# Altium schematic sheet Public_CPU_DDR4.SchDoc
size D
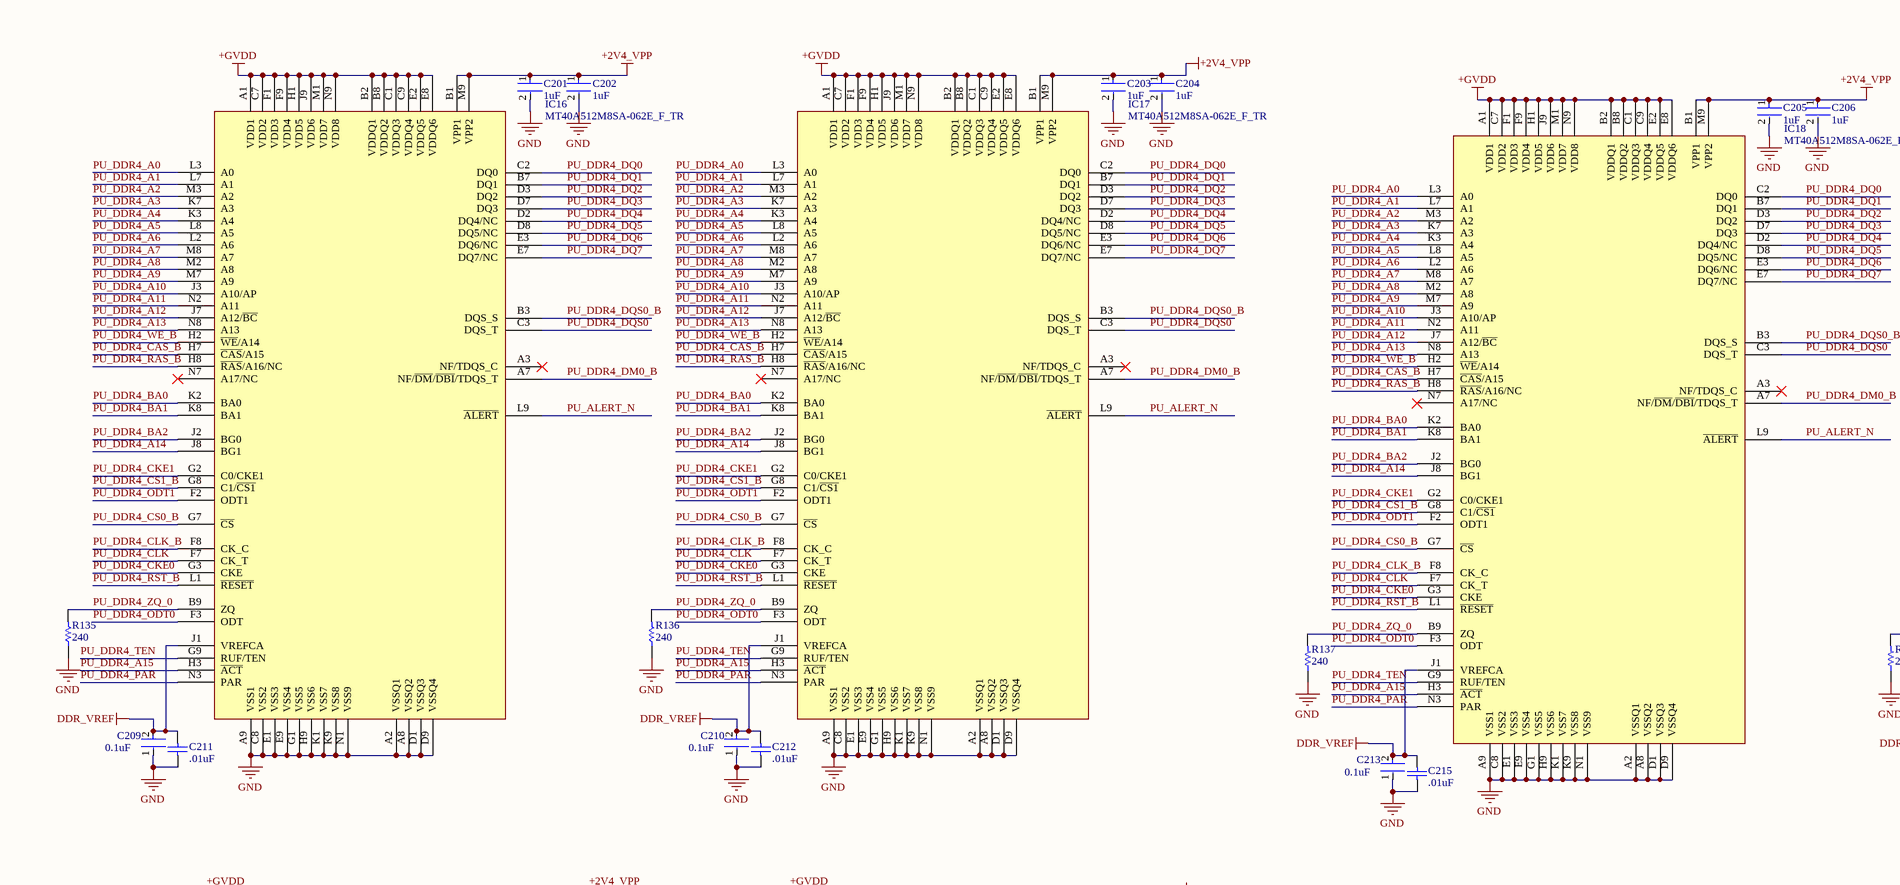
[diagram p0: Public_CPU_DDR4.SchDoc, top left]
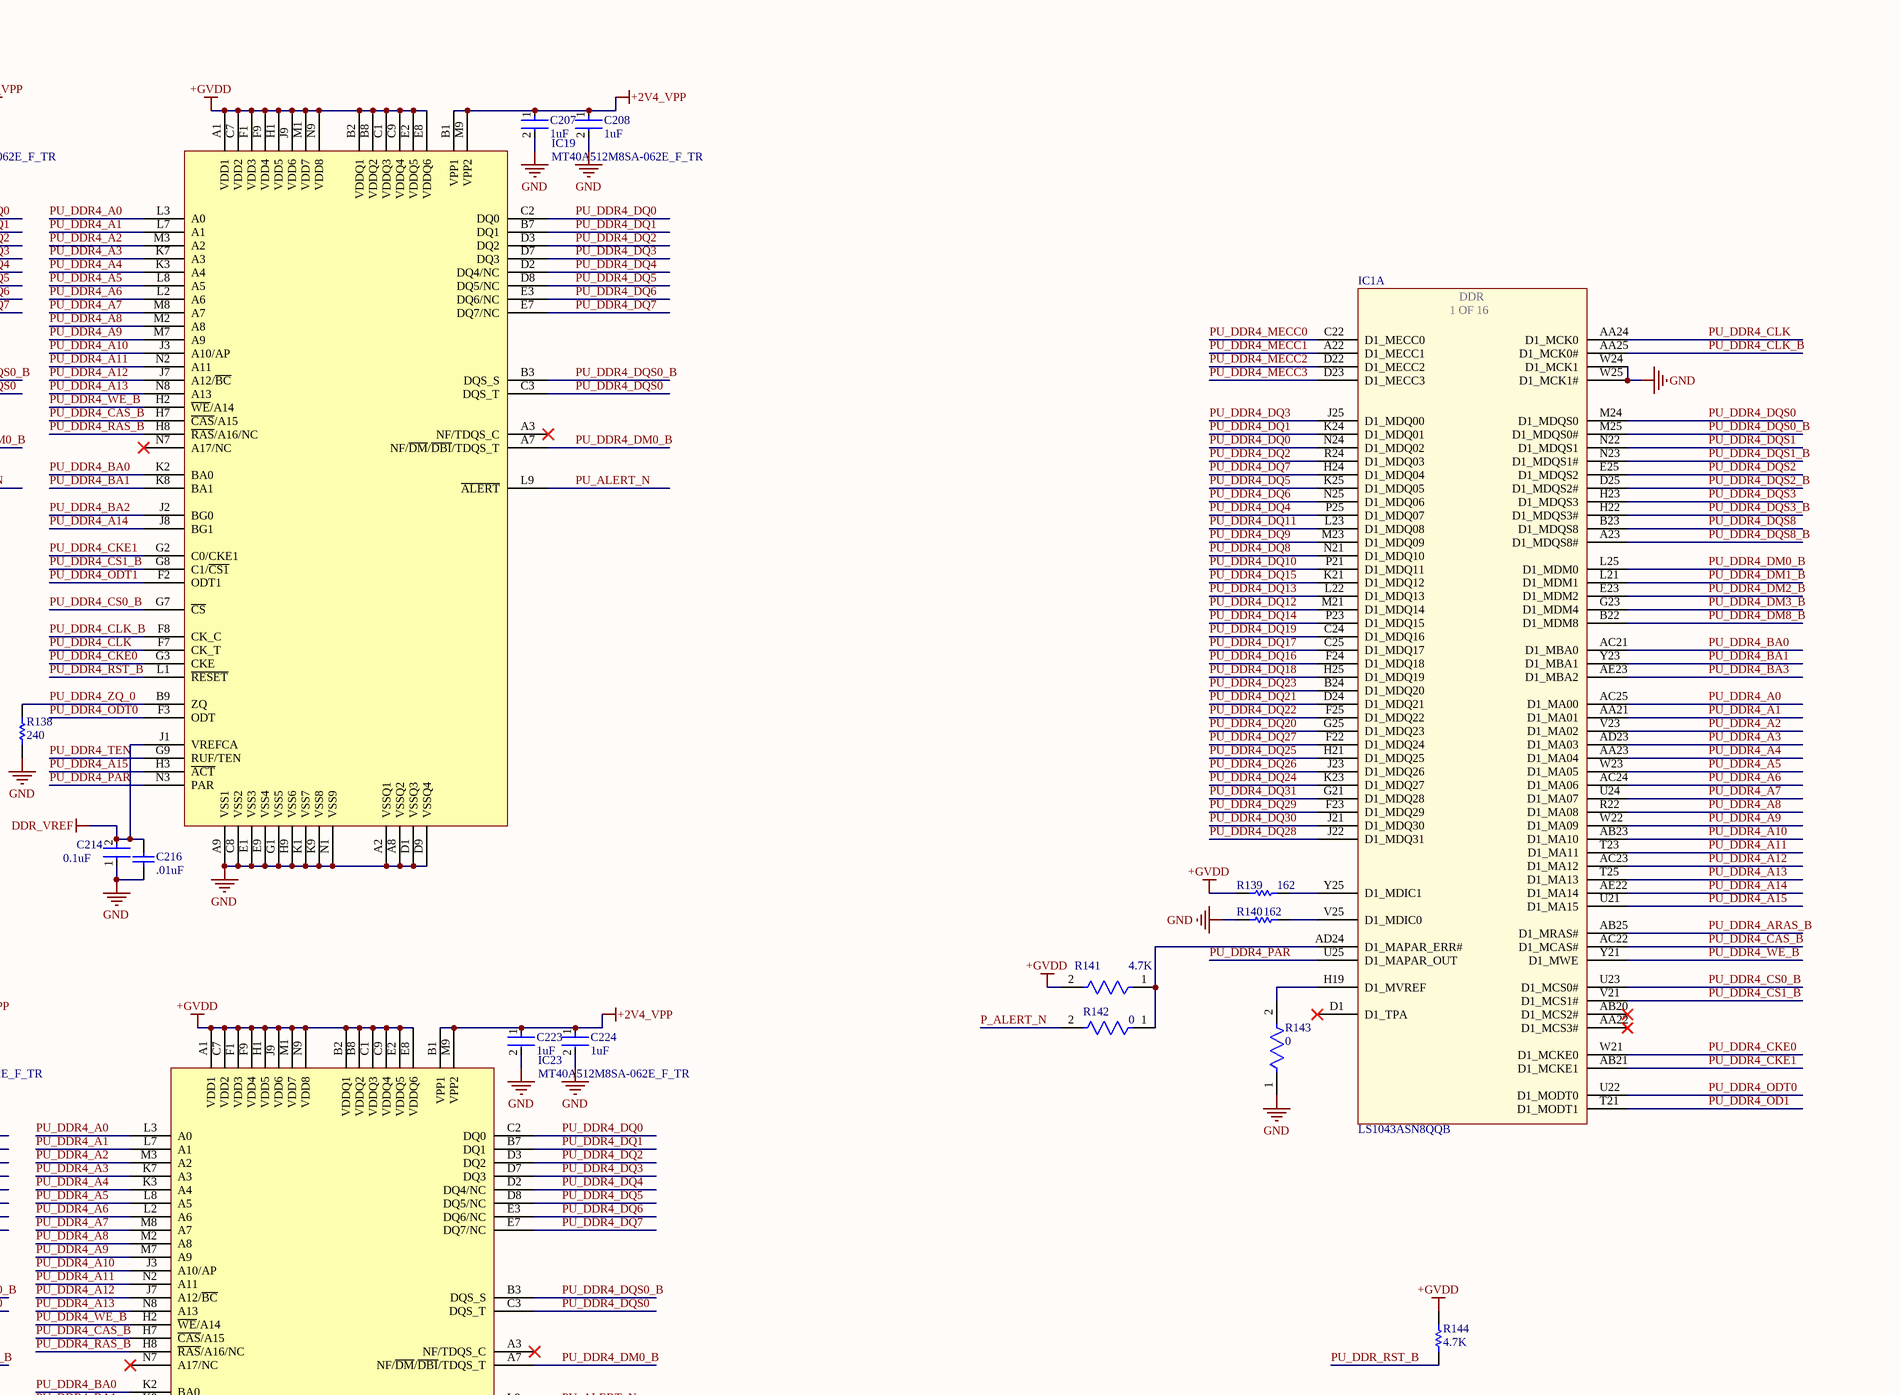
[diagram p1: Public_CPU_DDR4.SchDoc, top right]
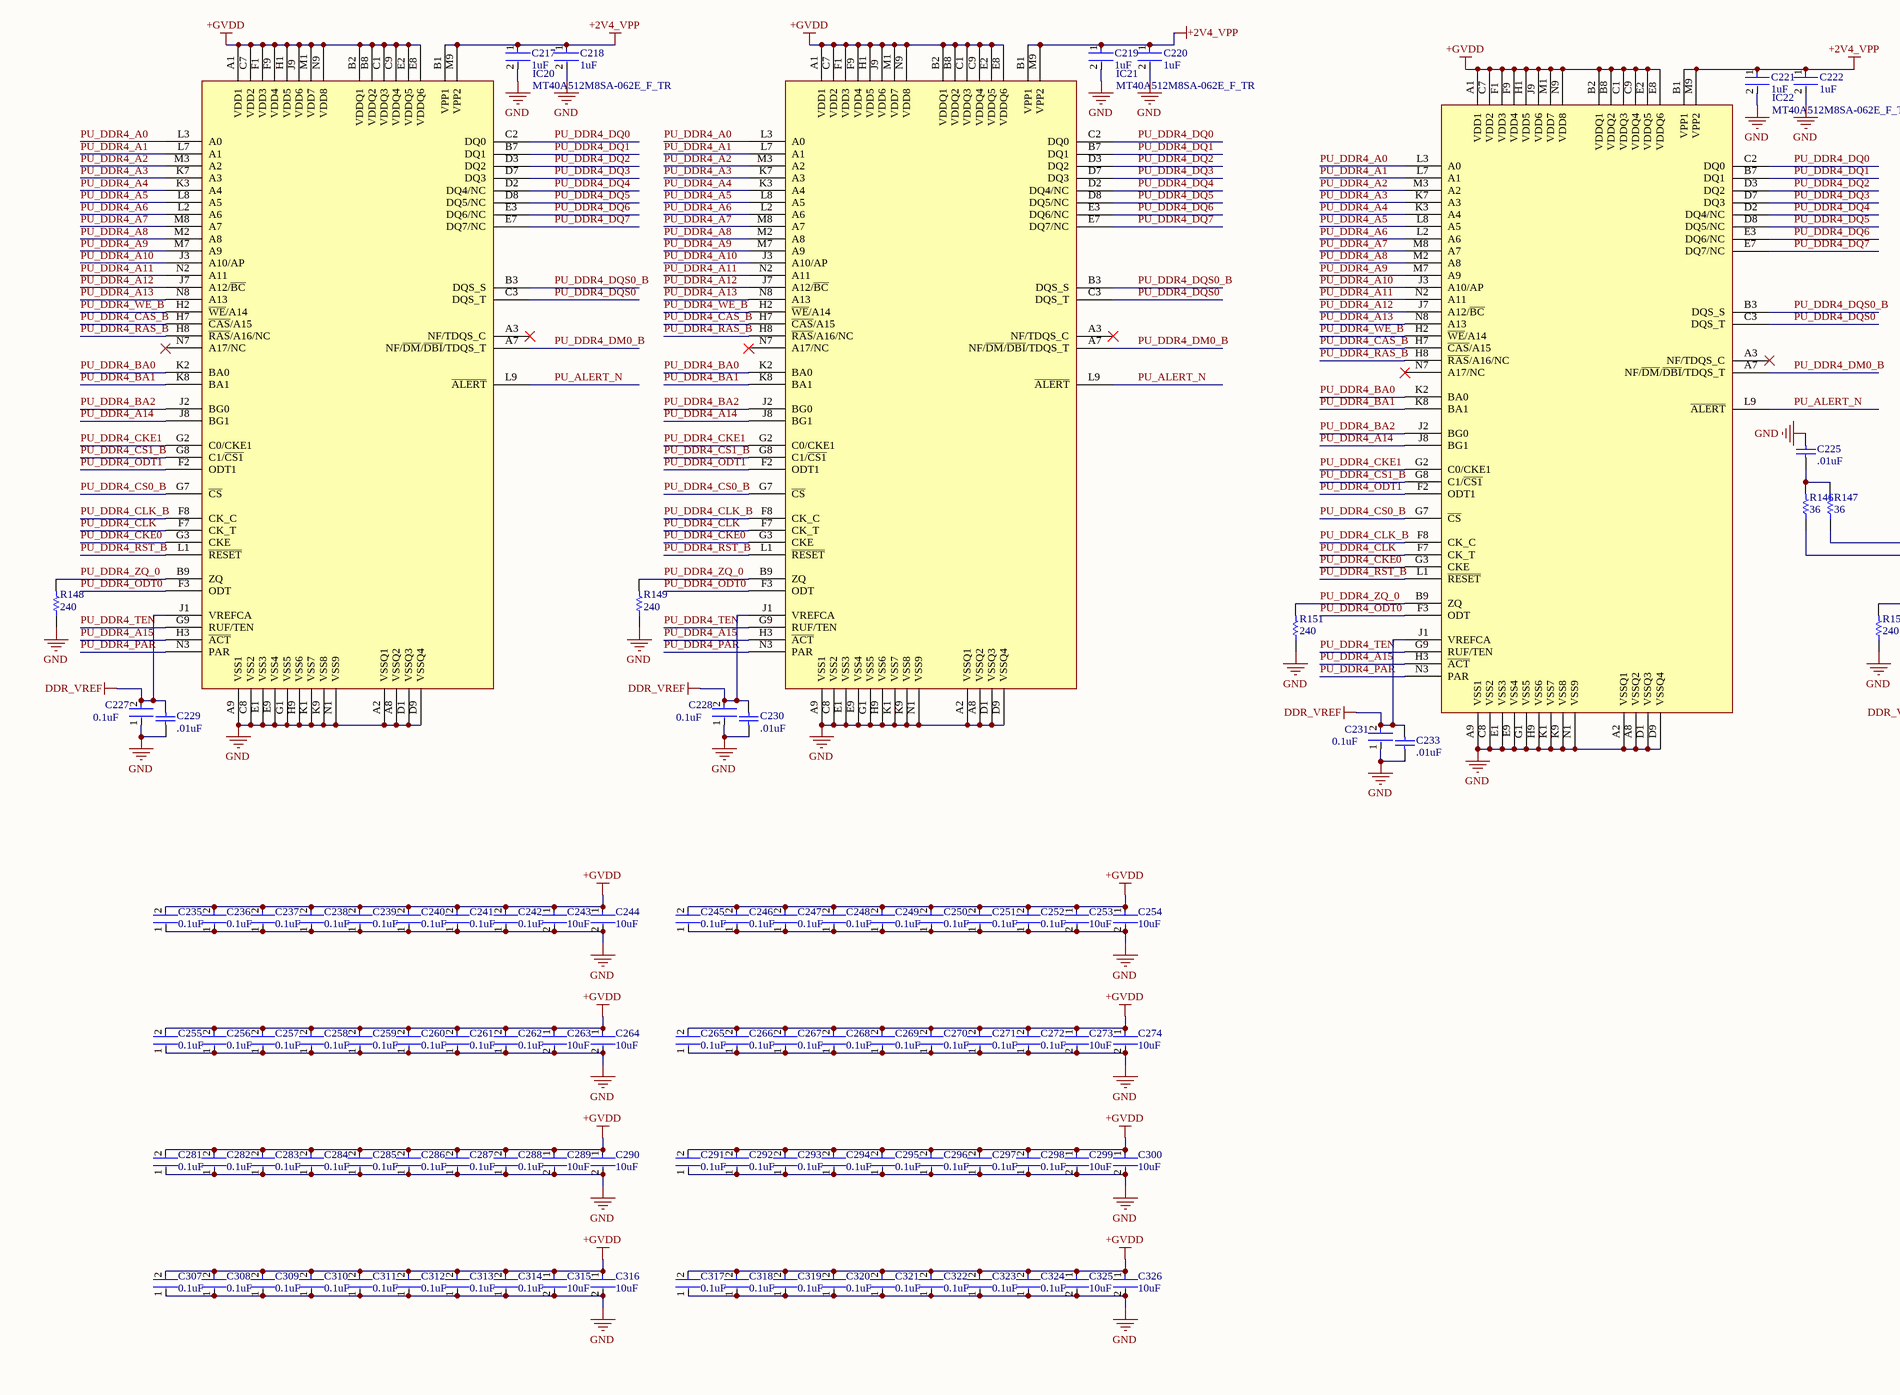
[diagram p2: Public_CPU_DDR4.SchDoc, bottom left]
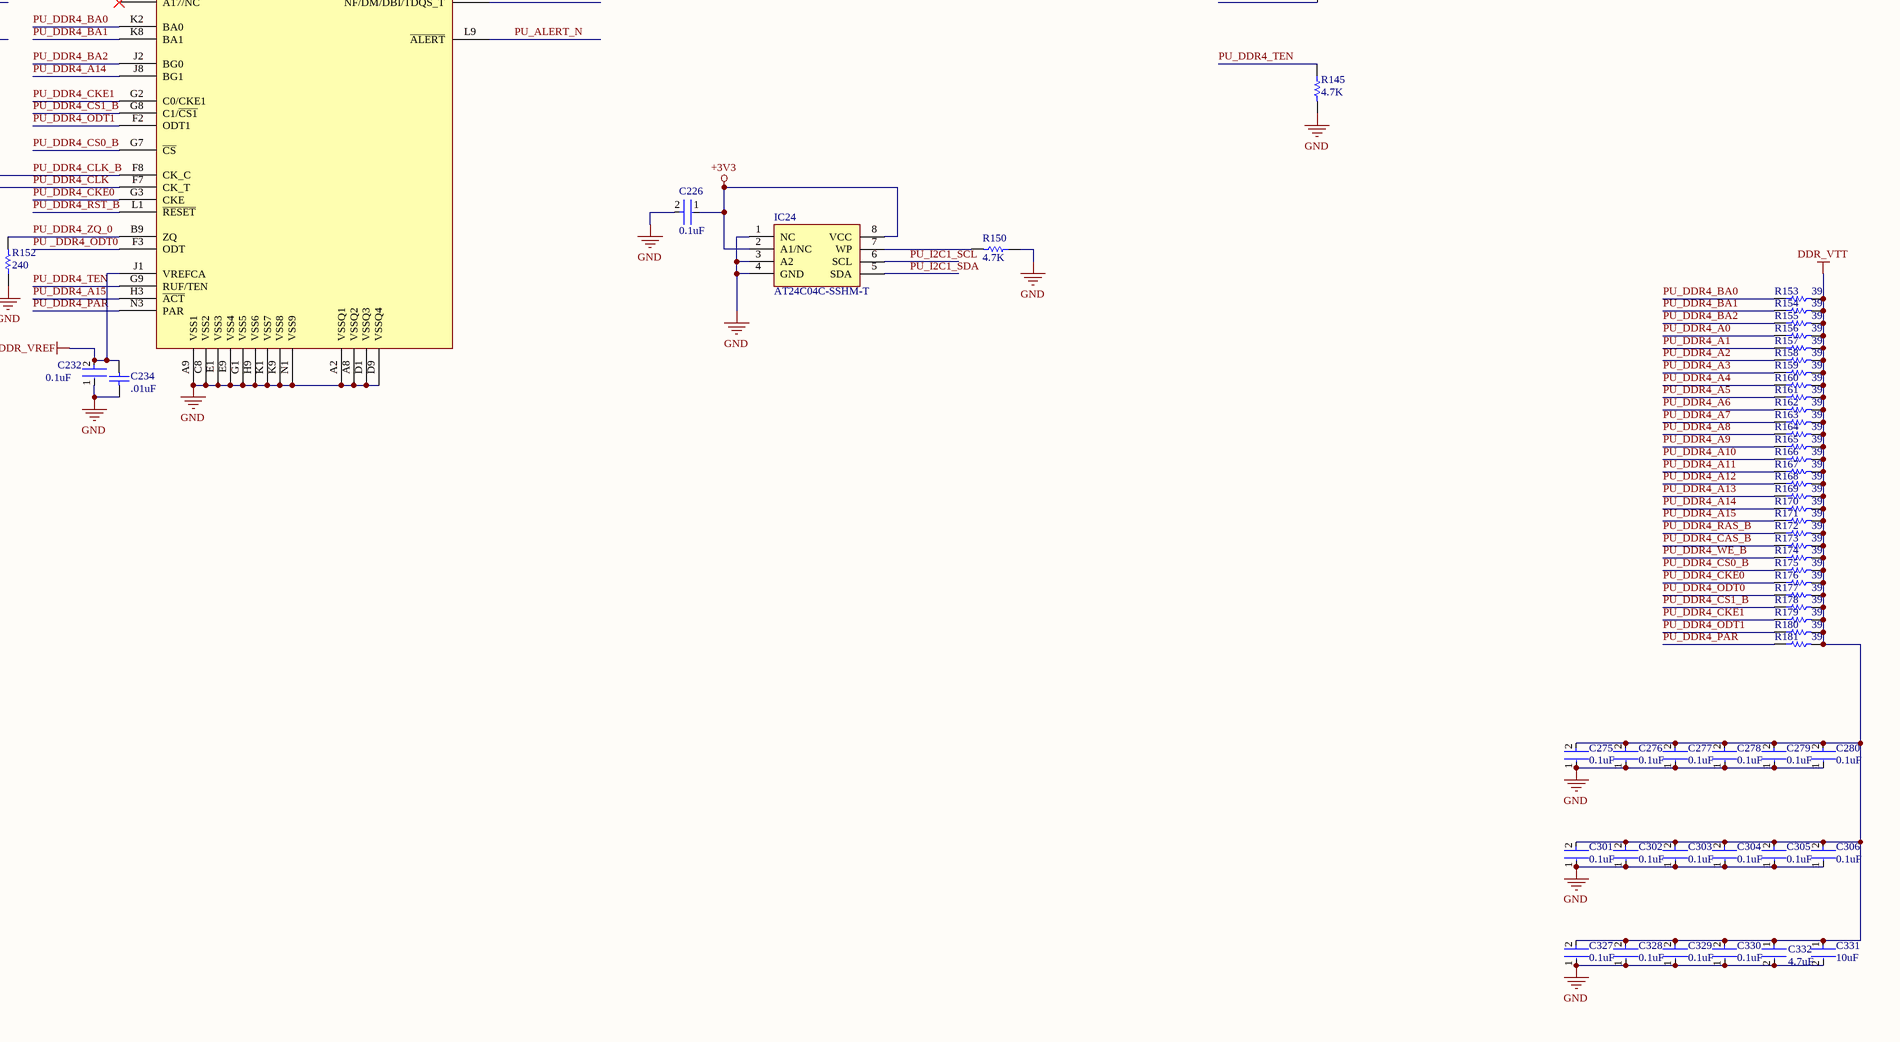
[diagram p3: Public_CPU_DDR4.SchDoc, bottom right]

## Parts
C201  1uF  [FP-GRM15-0_1-MFG]
C202  1uF  [FP-GRM15-0_1-MFG]
C203  1uF  [FP-GRM15-0_1-MFG]
C204  1uF  [FP-GRM15-0_1-MFG]
C205  1uF  [FP-GRM15-0_1-MFG]
C206  1uF  [FP-GRM15-0_1-MFG]
C207  1uF  [FP-GRM15-0_1-MFG]
C208  1uF  [FP-GRM15-0_1-MFG]
C209  0.1uF  [FP-GRM15-MFG]
C210  0.1uF  [FP-GRM15-MFG]
C211  .01uF  [CAPC1005X56X25LL10T15]
C212  .01uF  [CAPC1005X56X25LL10T15]
C213  0.1uF  [FP-GRM15-MFG]
C214  0.1uF  [FP-GRM15-MFG]
C215  .01uF  [CAPC1005X56X25LL10T15]
C216  .01uF  [CAPC1005X56X25LL10T15]
C217  1uF  [FP-GRM15-0_1-MFG]
C218  1uF  [FP-GRM15-0_1-MFG]
C219  1uF  [FP-GRM15-0_1-MFG]
C220  1uF  [FP-GRM15-0_1-MFG]
C221  1uF  [FP-GRM15-0_1-MFG]
C222  1uF  [FP-GRM15-0_1-MFG]
C223  1uF  [FP-GRM15-0_1-MFG]
C224  1uF  [FP-GRM15-0_1-MFG]
C225  .01uF  [CAPC1005X56X25LL10T15]
C226  0.1uF  [FP-GRM15-MFG]
C227  0.1uF  [FP-GRM15-MFG]
C228  0.1uF  [FP-GRM15-MFG]
C229  .01uF  [CAPC1005X56X25LL10T15]
C230  .01uF  [CAPC1005X56X25LL10T15]
C231  0.1uF  [FP-GRM15-MFG]
C232  0.1uF  [FP-GRM15-MFG]
C233  .01uF  [CAPC1005X56X25LL10T15]
C234  .01uF  [CAPC1005X56X25LL10T15]
C235  0.1uF  [FP-GRM15-MFG]
C236  0.1uF  [FP-GRM15-MFG]
C237  0.1uF  [FP-GRM15-MFG]
C238  0.1uF  [FP-GRM15-MFG]
C239  0.1uF  [FP-GRM15-MFG]
C240  0.1uF  [FP-GRM15-MFG]
C241  0.1uF  [FP-GRM15-MFG]
C242  0.1uF  [FP-GRM15-MFG]
C243  10uF  [FP-GRM21B-0_1-IPC_C]
C244  10uF  [FP-GRM21B-0_1-IPC_C]
C245  0.1uF  [FP-GRM15-MFG]
C246  0.1uF  [FP-GRM15-MFG]
C247  0.1uF  [FP-GRM15-MFG]
C248  0.1uF  [FP-GRM15-MFG]
C249  0.1uF  [FP-GRM15-MFG]
C250  0.1uF  [FP-GRM15-MFG]
C251  0.1uF  [FP-GRM15-MFG]
C252  0.1uF  [FP-GRM15-MFG]
C253  10uF  [FP-GRM21B-0_1-IPC_C]
C254  10uF  [FP-GRM21B-0_1-IPC_C]
C255  0.1uF  [FP-GRM15-MFG]
C256  0.1uF  [FP-GRM15-MFG]
C257  0.1uF  [FP-GRM15-MFG]
C258  0.1uF  [FP-GRM15-MFG]
C259  0.1uF  [FP-GRM15-MFG]
C260  0.1uF  [FP-GRM15-MFG]
C261  0.1uF  [FP-GRM15-MFG]
C262  0.1uF  [FP-GRM15-MFG]
C263  10uF  [FP-GRM21B-0_1-IPC_C]
C264  10uF  [FP-GRM21B-0_1-IPC_C]
C265  0.1uF  [FP-GRM15-MFG]
C266  0.1uF  [FP-GRM15-MFG]
C267  0.1uF  [FP-GRM15-MFG]
C268  0.1uF  [FP-GRM15-MFG]
C269  0.1uF  [FP-GRM15-MFG]
C270  0.1uF  [FP-GRM15-MFG]
C271  0.1uF  [FP-GRM15-MFG]
C272  0.1uF  [FP-GRM15-MFG]
C273  10uF  [FP-GRM21B-0_1-IPC_C]
C274  10uF  [FP-GRM21B-0_1-IPC_C]
C275  0.1uF  [FP-GRM15-MFG]
C276  0.1uF  [FP-GRM15-MFG]
C277  0.1uF  [FP-GRM15-MFG]
C278  0.1uF  [FP-GRM15-MFG]
C279  0.1uF  [FP-GRM15-MFG]
C280  0.1uF  [FP-GRM15-MFG]
C281  0.1uF  [FP-GRM15-MFG]
C282  0.1uF  [FP-GRM15-MFG]
C283  0.1uF  [FP-GRM15-MFG]
C284  0.1uF  [FP-GRM15-MFG]
C285  0.1uF  [FP-GRM15-MFG]
C286  0.1uF  [FP-GRM15-MFG]
C287  0.1uF  [FP-GRM15-MFG]
C288  0.1uF  [FP-GRM15-MFG]
C289  10uF  [FP-GRM21B-0_1-IPC_C]
C290  10uF  [FP-GRM21B-0_1-IPC_C]
C291  0.1uF  [FP-GRM15-MFG]
C292  0.1uF  [FP-GRM15-MFG]
C293  0.1uF  [FP-GRM15-MFG]
C294  0.1uF  [FP-GRM15-MFG]
C295  0.1uF  [FP-GRM15-MFG]
C296  0.1uF  [FP-GRM15-MFG]
C297  0.1uF  [FP-GRM15-MFG]
C298  0.1uF  [FP-GRM15-MFG]
C299  10uF  [FP-GRM21B-0_1-IPC_C]
C300  10uF  [FP-GRM21B-0_1-IPC_C]
C301  0.1uF  [FP-GRM15-MFG]
C302  0.1uF  [FP-GRM15-MFG]
C303  0.1uF  [FP-GRM15-MFG]
C304  0.1uF  [FP-GRM15-MFG]
C305  0.1uF  [FP-GRM15-MFG]
C306  0.1uF  [FP-GRM15-MFG]
C307  0.1uF  [FP-GRM15-MFG]
C308  0.1uF  [FP-GRM15-MFG]
C309  0.1uF  [FP-GRM15-MFG]
C310  0.1uF  [FP-GRM15-MFG]
C311  0.1uF  [FP-GRM15-MFG]
C312  0.1uF  [FP-GRM15-MFG]
C313  0.1uF  [FP-GRM15-MFG]
C314  0.1uF  [FP-GRM15-MFG]
C315  10uF  [FP-GRM21B-0_1-IPC_C]
C316  10uF  [FP-GRM21B-0_1-IPC_C]
C317  0.1uF  [FP-GRM15-MFG]
C318  0.1uF  [FP-GRM15-MFG]
C319  0.1uF  [FP-GRM15-MFG]
C320  0.1uF  [FP-GRM15-MFG]
C321  0.1uF  [FP-GRM15-MFG]
C322  0.1uF  [FP-GRM15-MFG]
C323  0.1uF  [FP-GRM15-MFG]
C324  0.1uF  [FP-GRM15-MFG]
C325  10uF  [FP-GRM21B-0_1-IPC_C]
C326  10uF  [FP-GRM21B-0_1-IPC_C]
C327  0.1uF  [FP-GRM15-MFG]
C328  0.1uF  [FP-GRM15-MFG]
C329  0.1uF  [FP-GRM15-MFG]
C330  0.1uF  [FP-GRM15-MFG]
C331  10uF  [FP-GRM21B-0_1-IPC_C]
C332  4.7uF  [FP-GRM155-0_1-IPC_B]
IC1  LS1043ASN8QQB  [BGA780C80P28X28_2300X2300X261]  (part A of 16)
IC16  MT40A512M8SA-062E_F_TR  [BGA78C80P9X13_750X1100X120]
IC17  MT40A512M8SA-062E_F_TR  [BGA78C80P9X13_750X1100X120]
IC18  MT40A512M8SA-062E_F_TR  [BGA78C80P9X13_750X1100X120]
IC19  MT40A512M8SA-062E_F_TR  [BGA78C80P9X13_750X1100X120]
IC20  MT40A512M8SA-062E_F_TR  [BGA78C80P9X13_750X1100X120]
IC21  MT40A512M8SA-062E_F_TR  [BGA78C80P9X13_750X1100X120]
IC22  MT40A512M8SA-062E_F_TR  [BGA78C80P9X13_750X1100X120]
IC23  MT40A512M8SA-062E_F_TR  [BGA78C80P9X13_750X1100X120]
IC24  AT24C04C-SSHM-T  [SOIC127P600X175-8N]
R135  240  [RESC1005X40X25ML05T05]
R136  240  [RESC1005X40X25ML05T05]
R137  240  [RESC1005X40X25ML05T05]
R138  240  [RESC1005X40X25ML05T05]
R139  162  [RESC1005X40X25LL05T05]
R140  162  [RESC1005X40X25LL05T05]
R141  4.7K  [FP-CRCW0402-e3-IPC_B]
R142  0  [FP-CRCW0402-e3-IPC_C]
R143  0  [FP-CRCW0402-e3-IPC_C]
R144  4.7K  [RESC1005X40X25LL05T05]
R145  4.7K  [RESC1005X40X25LL05T05]
R146  36  [RESC1005X40X25ML05T05]
R147  36  [RESC1005X40X25ML05T05]
R148  240  [RESC1005X40X25ML05T05]
R149  240  [RESC1005X40X25ML05T05]
R150  4.7K  [RESC1005X40X25LL05T05]
R151  240  [RESC1005X40X25ML05T05]
R152  240  [RESC1005X40X25ML05T05]
R153  39  [RESC1005X40X25LL05T05]
R154  39  [RESC1005X40X25LL05T05]
R155  39  [RESC1005X40X25LL05T05]
R156  39  [RESC1005X40X25LL05T05]
R157  39  [RESC1005X40X25LL05T05]
R158  39  [RESC1005X40X25LL05T05]
R159  39  [RESC1005X40X25LL05T05]
R160  39  [RESC1005X40X25LL05T05]
R161  39  [RESC1005X40X25LL05T05]
R162  39  [RESC1005X40X25LL05T05]
R163  39  [RESC1005X40X25LL05T05]
R164  39  [RESC1005X40X25LL05T05]
R165  39  [RESC1005X40X25LL05T05]
R166  39  [RESC1005X40X25LL05T05]
R167  39  [RESC1005X40X25LL05T05]
R168  39  [RESC1005X40X25LL05T05]
R169  39  [RESC1005X40X25LL05T05]
R170  39  [RESC1005X40X25LL05T05]
R171  39  [RESC1005X40X25LL05T05]
R172  39  [RESC1005X40X25LL05T05]
R173  39  [RESC1005X40X25LL05T05]
R174  39  [RESC1005X40X25LL05T05]
R175  39  [RESC1005X40X25LL05T05]
R176  39  [RESC1005X40X25LL05T05]
R177  39  [RESC1005X40X25LL05T05]
R178  39  [RESC1005X40X25LL05T05]
R179  39  [RESC1005X40X25LL05T05]
R180  39  [RESC1005X40X25LL05T05]
R181  39  [RESC1005X40X25LL05T05]

## Nets
+2V4_VPP: C201.1 C202.1 C203.1 C204.1 C205.1 C206.1 C207.1 C208.1 C217.1 C218.1 C219.1 C220.1 C221.1 C222.1 C223.1 C224.1 IC16.B1(VPP1) IC16.M9(VPP2) IC17.B1(VPP1) IC17.M9(VPP2) IC18.B1(VPP1) IC18.M9(VPP2) IC19.B1(VPP1) IC19.M9(VPP2) IC20.B1(VPP1) IC20.M9(VPP2) IC21.B1(VPP1) IC21.M9(VPP2) IC22.B1(VPP1) IC22.M9(VPP2) IC23.B1(VPP1) IC23.M9(VPP2)
+3V3: C226.1 IC24.2(A1/NC) IC24.8(VCC)
+GVDD: C235.2 C236.2 C237.2 C238.2 C239.2 C240.2 C241.2 C242.2 C243.1 C244.1 C245.2 C246.2 C247.2 C248.2 C249.2 C250.2 C251.2 C252.2 C253.1 C254.1 C255.2 C256.2 C257.2 C258.2 C259.2 C260.2 C261.2 C262.2 C263.1 C264.1 C265.2 C266.2 C267.2 C268.2 C269.2 C270.2 C271.2 C272.2 C273.1 C274.1 C281.2 C282.2 C283.2 C284.2 C285.2 C286.2 C287.2 C288.2 C289.1 C290.1 C291.2 C292.2 C293.2 C294.2 C295.2 C296.2 C297.2 C298.2 C299.1 C300.1 C307.2 C308.2 C309.2 C310.2 C311.2 C312.2 C313.2 C314.2 C315.1 C316.1 C317.2 C318.2 C319.2 C320.2 C321.2 C322.2 C323.2 C324.2 C325.1 C326.1 IC16.A1(VDD1) IC16.B2(VDDQ1) IC16.B8(VDDQ2) IC16.C1(VDDQ3) IC16.C7(VDD2) IC16.C9(VDDQ4) IC16.E2(VDDQ5) IC16.E8(VDDQ6) IC16.F1(VDD3) IC16.F9(VDD4) IC16.H1(VDD5) IC16.J9(VDD6) IC16.M1(VDD7) IC16.N9(VDD8) IC17.A1(VDD1) IC17.B2(VDDQ1) IC17.B8(VDDQ2) IC17.C1(VDDQ3) IC17.C7(VDD2) IC17.C9(VDDQ4) IC17.E2(VDDQ5) IC17.E8(VDDQ6) IC17.F1(VDD3) IC17.F9(VDD4) IC17.H1(VDD5) IC17.J9(VDD6) IC17.M1(VDD7) IC17.N9(VDD8) IC18.A1(VDD1) IC18.B2(VDDQ1) IC18.B8(VDDQ2) IC18.C1(VDDQ3) IC18.C7(VDD2) IC18.C9(VDDQ4) IC18.E2(VDDQ5) IC18.E8(VDDQ6) IC18.F1(VDD3) IC18.F9(VDD4) IC18.H1(VDD5) IC18.J9(VDD6) IC18.M1(VDD7) IC18.N9(VDD8) IC19.A1(VDD1) IC19.B2(VDDQ1) IC19.B8(VDDQ2) IC19.C1(VDDQ3) IC19.C7(VDD2) IC19.C9(VDDQ4) IC19.E2(VDDQ5) IC19.E8(VDDQ6) IC19.F1(VDD3) IC19.F9(VDD4) IC19.H1(VDD5) IC19.J9(VDD6) IC19.M1(VDD7) IC19.N9(VDD8) IC20.A1(VDD1) IC20.B2(VDDQ1) IC20.B8(VDDQ2) IC20.C1(VDDQ3) IC20.C7(VDD2) IC20.C9(VDDQ4) IC20.E2(VDDQ5) IC20.E8(VDDQ6) IC20.F1(VDD3) IC20.F9(VDD4) IC20.H1(VDD5) IC20.J9(VDD6) IC20.M1(VDD7) IC20.N9(VDD8) IC21.A1(VDD1) IC21.B2(VDDQ1) IC21.B8(VDDQ2) IC21.C1(VDDQ3) IC21.C7(VDD2) IC21.C9(VDDQ4) IC21.E2(VDDQ5) IC21.E8(VDDQ6) IC21.F1(VDD3) IC21.F9(VDD4) IC21.H1(VDD5) IC21.J9(VDD6) IC21.M1(VDD7) IC21.N9(VDD8) IC22.A1(VDD1) IC22.B2(VDDQ1) IC22.B8(VDDQ2) IC22.C1(VDDQ3) IC22.C7(VDD2) IC22.C9(VDDQ4) IC22.E2(VDDQ5) IC22.E8(VDDQ6) IC22.F1(VDD3) IC22.F9(VDD4) IC22.H1(VDD5) IC22.J9(VDD6) IC22.M1(VDD7) IC22.N9(VDD8) IC23.A1(VDD1) IC23.B2(VDDQ1) IC23.B8(VDDQ2) IC23.C1(VDDQ3) IC23.C7(VDD2) IC23.C9(VDDQ4) IC23.E2(VDDQ5) IC23.E8(VDDQ6) IC23.F1(VDD3) IC23.F9(VDD4) IC23.H1(VDD5) IC23.J9(VDD6) IC23.M1(VDD7) IC23.N9(VDD8) R139.1 R141.2 R144.1
DDR_VREF: C209.2 C210.2 C211.2 C212.2 C213.2 C214.2 C215.2 C216.2 C227.2 C228.2 C229.2 C230.2 C231.2 C232.2 C233.2 C234.2 IC16.J1(VREFCA) IC17.J1(VREFCA) IC18.J1(VREFCA) IC19.J1(VREFCA) IC20.J1(VREFCA) IC21.J1(VREFCA) IC22.J1(VREFCA) IC23.J1(VREFCA)
DDR_VTT: C275.2 C276.2 C277.2 C278.2 C279.2 C280.2 C301.2 C302.2 C303.2 C304.2 C305.2 C306.2 C327.2 C328.2 C329.2 C330.2 C331.1 C332.1 R153.2 R154.2 R155.2 R156.2 R157.2 R158.2 R159.2 R160.2 R161.2 R162.2 R163.2 R164.2 R165.2 R166.2 R167.2 R168.2 R169.2 R170.2 R171.2 R172.2 R173.2 R174.2 R175.2 R176.2 R177.2 R178.2 R179.2 R180.2 R181.2
GND: C201.2 C202.2 C203.2 C204.2 C205.2 C206.2 C207.2 C208.2 C209.1 C210.1 C211.1 C212.1 C213.1 C214.1 C215.1 C216.1 C217.2 C218.2 C219.2 C220.2 C221.2 C222.2 C223.2 C224.2 C225.2 C226.2 C227.1 C228.1 C229.1 C230.1 C231.1 C232.1 C233.1 C234.1 C235.1 C236.1 C237.1 C238.1 C239.1 C240.1 C241.1 C242.1 C243.2 C244.2 C245.1 C246.1 C247.1 C248.1 C249.1 C250.1 C251.1 C252.1 C253.2 C254.2 C255.1 C256.1 C257.1 C258.1 C259.1 C260.1 C261.1 C262.1 C263.2 C264.2 C265.1 C266.1 C267.1 C268.1 C269.1 C270.1 C271.1 C272.1 C273.2 C274.2 C275.1 C276.1 C277.1 C278.1 C279.1 C280.1 C281.1 C282.1 C283.1 C284.1 C285.1 C286.1 C287.1 C288.1 C289.2 C290.2 C291.1 C292.1 C293.1 C294.1 C295.1 C296.1 C297.1 C298.1 C299.2 C300.2 C301.1 C302.1 C303.1 C304.1 C305.1 C306.1 C307.1 C308.1 C309.1 C310.1 C311.1 C312.1 C313.1 C314.1 C315.2 C316.2 C317.1 C318.1 C319.1 C320.1 C321.1 C322.1 C323.1 C324.1 C325.2 C326.2 C327.1 C328.1 C329.1 C330.1 C331.2 C332.2 IC1.W24(D1_MCK1) IC1.W25(D1_MCK1#) IC16.A2(VSSQ1) IC16.A8(VSSQ2) IC16.A9(VSS1) IC16.C8(VSS2) IC16.D1(VSSQ3) IC16.D9(VSSQ4) IC16.E1(VSS3) IC16.E9(VSS4) IC16.G1(VSS5) IC16.H9(VSS6) IC16.K1(VSS7) IC16.K9(VSS8) IC16.N1(VSS9) IC17.A2(VSSQ1) IC17.A8(VSSQ2) IC17.A9(VSS1) IC17.C8(VSS2) IC17.D1(VSSQ3) IC17.D9(VSSQ4) IC17.E1(VSS3) IC17.E9(VSS4) IC17.G1(VSS5) IC17.H9(VSS6) IC17.K1(VSS7) IC17.K9(VSS8) IC17.N1(VSS9) IC18.A2(VSSQ1) IC18.A8(VSSQ2) IC18.A9(VSS1) IC18.C8(VSS2) IC18.D1(VSSQ3) IC18.D9(VSSQ4) IC18.E1(VSS3) IC18.E9(VSS4) IC18.G1(VSS5) IC18.H9(VSS6) IC18.K1(VSS7) IC18.K9(VSS8) IC18.N1(VSS9) IC19.A2(VSSQ1) IC19.A8(VSSQ2) IC19.A9(VSS1) IC19.C8(VSS2) IC19.D1(VSSQ3) IC19.D9(VSSQ4) IC19.E1(VSS3) IC19.E9(VSS4) IC19.G1(VSS5) IC19.H9(VSS6) IC19.K1(VSS7) IC19.K9(VSS8) IC19.N1(VSS9) IC20.A2(VSSQ1) IC20.A8(VSSQ2) IC20.A9(VSS1) IC20.C8(VSS2) IC20.D1(VSSQ3) IC20.D9(VSSQ4) IC20.E1(VSS3) IC20.E9(VSS4) IC20.G1(VSS5) IC20.H9(VSS6) IC20.K1(VSS7) IC20.K9(VSS8) IC20.N1(VSS9) IC21.A2(VSSQ1) IC21.A8(VSSQ2) IC21.A9(VSS1) IC21.C8(VSS2) IC21.D1(VSSQ3) IC21.D9(VSSQ4) IC21.E1(VSS3) IC21.E9(VSS4) IC21.G1(VSS5) IC21.H9(VSS6) IC21.K1(VSS7) IC21.K9(VSS8) IC21.N1(VSS9) IC22.A2(VSSQ1) IC22.A8(VSSQ2) IC22.A9(VSS1) IC22.C8(VSS2) IC22.D1(VSSQ3) IC22.D9(VSSQ4) IC22.E1(VSS3) IC22.E9(VSS4) IC22.G1(VSS5) IC22.H9(VSS6) IC22.K1(VSS7) IC22.K9(VSS8) IC22.N1(VSS9) IC23.A2(VSSQ1) IC23.A8(VSSQ2) IC23.A9(VSS1) IC23.C8(VSS2) IC23.D1(VSSQ3) IC23.D9(VSSQ4) IC23.E1(VSS3) IC23.E9(VSS4) IC23.G1(VSS5) IC23.H9(VSS6) IC23.K1(VSS7) IC23.K9(VSS8) IC23.N1(VSS9) IC24.1(NC) IC24.3(A2) IC24.4(GND) R135.1 R136.1 R137.1 R138.1 R140.1 R143.1 R145.2 R148.1 R149.1 R150.1 R151.1 R152.1
P_ALERT_N: R142.2
PU _DDR4_ODT0: IC23.F3(ODT)
PU_ALERT_N: IC16.L9(~{ALERT}) IC17.L9(~{ALERT}) IC18.L9(~{ALERT}) IC19.L9(~{ALERT}) IC20.L9(~{ALERT}) IC21.L9(~{ALERT}) IC22.L9(~{ALERT}) IC23.L9(~{ALERT})
PU_DDR4_A0: IC1.AC25(D1_MA00) IC16.L3(A0) IC17.L3(A0) IC18.L3(A0) IC19.L3(A0) IC20.L3(A0) IC21.L3(A0) IC22.L3(A0) IC23.L3(A0) R156.1
PU_DDR4_A1: IC1.AA21(D1_MA01) IC16.L7(A1) IC17.L7(A1) IC18.L7(A1) IC19.L7(A1) IC20.L7(A1) IC21.L7(A1) IC22.L7(A1) IC23.L7(A1) R157.1
PU_DDR4_A2: IC1.V23(D1_MA02) IC16.M3(A2) IC17.M3(A2) IC18.M3(A2) IC19.M3(A2) IC20.M3(A2) IC21.M3(A2) IC22.M3(A2) IC23.M3(A2) R158.1
PU_DDR4_A3: IC1.AD23(D1_MA03) IC16.K7(A3) IC17.K7(A3) IC18.K7(A3) IC19.K7(A3) IC20.K7(A3) IC21.K7(A3) IC22.K7(A3) IC23.K7(A3) R159.1
PU_DDR4_A4: IC1.AA23(D1_MA04) IC16.K3(A4) IC17.K3(A4) IC18.K3(A4) IC19.K3(A4) IC20.K3(A4) IC21.K3(A4) IC22.K3(A4) IC23.K3(A4) R160.1
PU_DDR4_A5: IC1.W23(D1_MA05) IC16.L8(A5) IC17.L8(A5) IC18.L8(A5) IC19.L8(A5) IC20.L8(A5) IC21.L8(A5) IC22.L8(A5) IC23.L8(A5) R161.1
PU_DDR4_A6: IC1.AC24(D1_MA06) IC16.L2(A6) IC17.L2(A6) IC18.L2(A6) IC19.L2(A6) IC20.L2(A6) IC21.L2(A6) IC22.L2(A6) IC23.L2(A6) R162.1
PU_DDR4_A7: IC1.U24(D1_MA07) IC16.M8(A7) IC17.M8(A7) IC18.M8(A7) IC19.M8(A7) IC20.M8(A7) IC21.M8(A7) IC22.M8(A7) IC23.M8(A7) R163.1
PU_DDR4_A8: IC1.R22(D1_MA08) IC16.M2(A8) IC17.M2(A8) IC18.M2(A8) IC19.M2(A8) IC20.M2(A8) IC21.M2(A8) IC22.M2(A8) IC23.M2(A8) R164.1
PU_DDR4_A9: IC1.W22(D1_MA09) IC16.M7(A9) IC17.M7(A9) IC18.M7(A9) IC19.M7(A9) IC20.M7(A9) IC21.M7(A9) IC22.M7(A9) IC23.M7(A9) R165.1
PU_DDR4_A10: IC1.AB23(D1_MA10) IC16.J3(A10/AP) IC17.J3(A10/AP) IC18.J3(A10/AP) IC19.J3(A10/AP) IC20.J3(A10/AP) IC21.J3(A10/AP) IC22.J3(A10/AP) IC23.J3(A10/AP) R166.1
PU_DDR4_A11: IC1.T23(D1_MA11) IC16.N2(A11) IC17.N2(A11) IC18.N2(A11) IC19.N2(A11) IC20.N2(A11) IC21.N2(A11) IC22.N2(A11) IC23.N2(A11) R167.1
PU_DDR4_A12: IC1.AC23(D1_MA12) IC16.J7(A12/~{BC}) IC17.J7(A12/~{BC}) IC18.J7(A12/~{BC}) IC19.J7(A12/~{BC}) IC20.J7(A12/~{BC}) IC21.J7(A12/~{BC}) IC22.J7(A12/~{BC}) IC23.J7(A12/~{BC}) R168.1
PU_DDR4_A13: IC1.T25(D1_MA13) IC16.N8(A13) IC17.N8(A13) IC18.N8(A13) IC19.N8(A13) IC20.N8(A13) IC21.N8(A13) IC22.N8(A13) IC23.N8(A13) R169.1
PU_DDR4_A14: IC1.AE22(D1_MA14) IC16.J8(BG1) IC17.J8(BG1) IC18.J8(BG1) IC19.J8(BG1) IC20.J8(BG1) IC21.J8(BG1) IC22.J8(BG1) IC23.J8(BG1) R170.1
PU_DDR4_A15: IC1.U21(D1_MA15) IC16.H3(~{ACT}) IC17.H3(~{ACT}) IC18.H3(~{ACT}) IC19.H3(~{ACT}) IC20.H3(~{ACT}) IC21.H3(~{ACT}) IC22.H3(~{ACT}) IC23.H3(~{ACT}) R171.1
PU_DDR4_ARAS_B: IC1.AB25(D1_MRAS#)
PU_DDR4_BA0: IC1.AC21(D1_MBA0) IC16.K2(BA0) IC17.K2(BA0) IC18.K2(BA0) IC19.K2(BA0) IC20.K2(BA0) IC21.K2(BA0) IC22.K2(BA0) IC23.K2(BA0) R153.1
PU_DDR4_BA1: IC1.Y23(D1_MBA1) IC16.K8(BA1) IC17.K8(BA1) IC18.K8(BA1) IC19.K8(BA1) IC20.K8(BA1) IC21.K8(BA1) IC22.K8(BA1) IC23.K8(BA1) R154.1
PU_DDR4_BA2: IC16.J2(BG0) IC17.J2(BG0) IC18.J2(BG0) IC19.J2(BG0) IC20.J2(BG0) IC21.J2(BG0) IC22.J2(BG0) IC23.J2(BG0) R155.1
PU_DDR4_BA3: IC1.AE23(D1_MBA2)
PU_DDR4_CAS_B: IC1.AC22(D1_MCAS#) IC16.H7(~{CAS}/A15) IC17.H7(~{CAS}/A15) IC18.H7(~{CAS}/A15) IC19.H7(~{CAS}/A15) IC20.H7(~{CAS}/A15) IC21.H7(~{CAS}/A15) IC22.H7(~{CAS}/A15) IC23.H7(~{CAS}/A15) R173.1
PU_DDR4_CKE0: IC1.W21(D1_MCKE0) IC16.G3(CKE) IC17.G3(CKE) IC18.G3(CKE) IC19.G3(CKE) IC20.G3(CKE) IC21.G3(CKE) IC22.G3(CKE) IC23.G3(CKE) R176.1
PU_DDR4_CKE1: IC1.AB21(D1_MCKE1) IC16.G2(C0/CKE1) IC17.G2(C0/CKE1) IC18.G2(C0/CKE1) IC19.G2(C0/CKE1) IC20.G2(C0/CKE1) IC21.G2(C0/CKE1) IC22.G2(C0/CKE1) IC23.G2(C0/CKE1) R179.1
PU_DDR4_CLK: IC1.AA24(D1_MCK0) IC16.F7(CK_T) IC17.F7(CK_T) IC18.F7(CK_T) IC19.F7(CK_T) IC20.F7(CK_T) IC21.F7(CK_T) IC22.F7(CK_T) IC23.F7(CK_T) R146.1
PU_DDR4_CLK_B: IC1.AA25(D1_MCK0#) IC16.F8(CK_C) IC17.F8(CK_C) IC18.F8(CK_C) IC19.F8(CK_C) IC20.F8(CK_C) IC21.F8(CK_C) IC22.F8(CK_C) IC23.F8(CK_C) R147.1
PU_DDR4_CS0_B: IC1.U23(D1_MCS0#) IC16.G7(~{CS}) IC17.G7(~{CS}) IC18.G7(~{CS}) IC19.G7(~{CS}) IC20.G7(~{CS}) IC21.G7(~{CS}) IC22.G7(~{CS}) IC23.G7(~{CS}) R175.1
PU_DDR4_CS1_B: IC1.V21(D1_MCS1#) IC16.G8(C1/~{CS1}) IC17.G8(C1/~{CS1}) IC18.G8(C1/~{CS1}) IC19.G8(C1/~{CS1}) IC20.G8(C1/~{CS1}) IC21.G8(C1/~{CS1}) IC22.G8(C1/~{CS1}) IC23.G8(C1/~{CS1}) R178.1
PU_DDR4_DM0_B: IC1.L25(D1_MDM0) IC16.A7(NF/~{DM}/~{DBI}/TDQS_T) IC17.A7(NF/~{DM}/~{DBI}/TDQS_T) IC18.A7(NF/~{DM}/~{DBI}/TDQS_T) IC19.A7(NF/~{DM}/~{DBI}/TDQS_T) IC20.A7(NF/~{DM}/~{DBI}/TDQS_T) IC21.A7(NF/~{DM}/~{DBI}/TDQS_T) IC22.A7(NF/~{DM}/~{DBI}/TDQS_T) IC23.A7(NF/~{DM}/~{DBI}/TDQS_T)
PU_DDR4_DM1_B: IC1.L21(D1_MDM1)
PU_DDR4_DM2_B: IC1.E23(D1_MDM2)
PU_DDR4_DM3_B: IC1.G23(D1_MDM4)
PU_DDR4_DM8_B: IC1.B22(D1_MDM8)
PU_DDR4_DQ0: IC1.N24(D1_MDQ02) IC16.C2(DQ0) IC17.C2(DQ0) IC18.C2(DQ0) IC19.C2(DQ0) IC20.C2(DQ0) IC21.C2(DQ0) IC22.C2(DQ0) IC23.C2(DQ0)
PU_DDR4_DQ1: IC1.K24(D1_MDQ01) IC16.B7(DQ1) IC17.B7(DQ1) IC18.B7(DQ1) IC19.B7(DQ1) IC20.B7(DQ1) IC21.B7(DQ1) IC22.B7(DQ1) IC23.B7(DQ1)
PU_DDR4_DQ2: IC1.R24(D1_MDQ03) IC16.D3(DQ2) IC17.D3(DQ2) IC18.D3(DQ2) IC19.D3(DQ2) IC20.D3(DQ2) IC21.D3(DQ2) IC22.D3(DQ2) IC23.D3(DQ2)
PU_DDR4_DQ3: IC1.J25(D1_MDQ00) IC16.D7(DQ3) IC17.D7(DQ3) IC18.D7(DQ3) IC19.D7(DQ3) IC20.D7(DQ3) IC21.D7(DQ3) IC22.D7(DQ3) IC23.D7(DQ3)
PU_DDR4_DQ4: IC1.P25(D1_MDQ07) IC16.D2(DQ4/NC) IC17.D2(DQ4/NC) IC18.D2(DQ4/NC) IC19.D2(DQ4/NC) IC20.D2(DQ4/NC) IC21.D2(DQ4/NC) IC22.D2(DQ4/NC) IC23.D2(DQ4/NC)
PU_DDR4_DQ5: IC1.K25(D1_MDQ05) IC16.D8(DQ5/NC) IC17.D8(DQ5/NC) IC18.D8(DQ5/NC) IC19.D8(DQ5/NC) IC20.D8(DQ5/NC) IC21.D8(DQ5/NC) IC22.D8(DQ5/NC) IC23.D8(DQ5/NC)
PU_DDR4_DQ6: IC1.N25(D1_MDQ06) IC16.E3(DQ6/NC) IC17.E3(DQ6/NC) IC18.E3(DQ6/NC) IC19.E3(DQ6/NC) IC20.E3(DQ6/NC) IC21.E3(DQ6/NC) IC22.E3(DQ6/NC) IC23.E3(DQ6/NC)
PU_DDR4_DQ7: IC1.H24(D1_MDQ04) IC16.E7(DQ7/NC) IC17.E7(DQ7/NC) IC18.E7(DQ7/NC) IC19.E7(DQ7/NC) IC20.E7(DQ7/NC) IC21.E7(DQ7/NC) IC22.E7(DQ7/NC) IC23.E7(DQ7/NC)
PU_DDR4_DQ8: IC1.N21(D1_MDQ10)
PU_DDR4_DQ9: IC1.M23(D1_MDQ09)
PU_DDR4_DQ10: IC1.P21(D1_MDQ11)
PU_DDR4_DQ11: IC1.L23(D1_MDQ08)
PU_DDR4_DQ12: IC1.M21(D1_MDQ14)
PU_DDR4_DQ13: IC1.L22(D1_MDQ13)
PU_DDR4_DQ14: IC1.P23(D1_MDQ15)
PU_DDR4_DQ15: IC1.K21(D1_MDQ12)
PU_DDR4_DQ16: IC1.F24(D1_MDQ18)
PU_DDR4_DQ17: IC1.C25(D1_MDQ17)
PU_DDR4_DQ18: IC1.H25(D1_MDQ19)
PU_DDR4_DQ19: IC1.C24(D1_MDQ16)
PU_DDR4_DQ20: IC1.G25(D1_MDQ23)
PU_DDR4_DQ21: IC1.D24(D1_MDQ21)
PU_DDR4_DQ22: IC1.F25(D1_MDQ22)
PU_DDR4_DQ23: IC1.B24(D1_MDQ20)
PU_DDR4_DQ24: IC1.K23(D1_MDQ27)
PU_DDR4_DQ25: IC1.H21(D1_MDQ25)
PU_DDR4_DQ26: IC1.J23(D1_MDQ26)
PU_DDR4_DQ27: IC1.F22(D1_MDQ24)
PU_DDR4_DQ28: IC1.J22(D1_MDQ31)
PU_DDR4_DQ29: IC1.F23(D1_MDQ29)
PU_DDR4_DQ30: IC1.J21(D1_MDQ30)
PU_DDR4_DQ31: IC1.G21(D1_MDQ28)
PU_DDR4_DQS0: IC1.M24(D1_MDQS0) IC16.C3(DQS_T) IC17.C3(DQS_T) IC18.C3(DQS_T) IC19.C3(DQS_T) IC20.C3(DQS_T) IC21.C3(DQS_T) IC22.C3(DQS_T) IC23.C3(DQS_T)
PU_DDR4_DQS0_B: IC1.M25(D1_MDQS0#) IC16.B3(DQS_S) IC17.B3(DQS_S) IC18.B3(DQS_S) IC19.B3(DQS_S) IC20.B3(DQS_S) IC21.B3(DQS_S) IC22.B3(DQS_S) IC23.B3(DQS_S)
PU_DDR4_DQS1: IC1.N22(D1_MDQS1)
PU_DDR4_DQS1_B: IC1.N23(D1_MDQS1#)
PU_DDR4_DQS2: IC1.E25(D1_MDQS2)
PU_DDR4_DQS2_B: IC1.D25(D1_MDQS2#)
PU_DDR4_DQS3: IC1.H23(D1_MDQS3)
PU_DDR4_DQS3_B: IC1.H22(D1_MDQS3#)
PU_DDR4_DQS8: IC1.B23(D1_MDQS8)
PU_DDR4_DQS8_B: IC1.A23(D1_MDQS8#)
PU_DDR4_MECC0: IC1.C22(D1_MECC0)
PU_DDR4_MECC1: IC1.A22(D1_MECC1)
PU_DDR4_MECC2: IC1.D22(D1_MECC2)
PU_DDR4_MECC3: IC1.D23(D1_MECC3)
PU_DDR4_OD1: IC1.T21(D1_MODT1)
PU_DDR4_ODT0: IC1.U22(D1_MODT0) IC16.F3(ODT) IC17.F3(ODT) IC18.F3(ODT) IC19.F3(ODT) IC20.F3(ODT) IC21.F3(ODT) IC22.F3(ODT) R177.1
PU_DDR4_ODT1: IC16.F2(ODT1) IC17.F2(ODT1) IC18.F2(ODT1) IC19.F2(ODT1) IC20.F2(ODT1) IC21.F2(ODT1) IC22.F2(ODT1) IC23.F2(ODT1) R180.1
PU_DDR4_PAR: IC1.U25(D1_MAPAR_OUT) IC16.N3(PAR) IC17.N3(PAR) IC18.N3(PAR) IC19.N3(PAR) IC20.N3(PAR) IC21.N3(PAR) IC22.N3(PAR) IC23.N3(PAR) R181.1
PU_DDR4_RAS_B: IC16.H8(~{RAS}/A16/NC) IC17.H8(~{RAS}/A16/NC) IC18.H8(~{RAS}/A16/NC) IC19.H8(~{RAS}/A16/NC) IC20.H8(~{RAS}/A16/NC) IC21.H8(~{RAS}/A16/NC) IC22.H8(~{RAS}/A16/NC) IC23.H8(~{RAS}/A16/NC) R172.1
PU_DDR4_RST_B: IC16.L1(~{RESET}) IC17.L1(~{RESET}) IC18.L1(~{RESET}) IC19.L1(~{RESET}) IC20.L1(~{RESET}) IC21.L1(~{RESET}) IC22.L1(~{RESET}) IC23.L1(~{RESET})
PU_DDR4_TEN: IC16.G9(RUF/TEN) IC17.G9(RUF/TEN) IC18.G9(RUF/TEN) IC19.G9(RUF/TEN) IC20.G9(RUF/TEN) IC21.G9(RUF/TEN) IC22.G9(RUF/TEN) IC23.G9(RUF/TEN) R145.1
PU_DDR4_WE_B: IC1.Y21(D1_MWE) IC16.H2(~{WE}/A14) IC17.H2(~{WE}/A14) IC18.H2(~{WE}/A14) IC19.H2(~{WE}/A14) IC20.H2(~{WE}/A14) IC21.H2(~{WE}/A14) IC22.H2(~{WE}/A14) IC23.H2(~{WE}/A14) R174.1
PU_DDR4_ZQ_0: IC16.B9(ZQ) IC17.B9(ZQ) IC18.B9(ZQ) IC19.B9(ZQ) IC20.B9(ZQ) IC21.B9(ZQ) IC22.B9(ZQ) IC23.B9(ZQ) R135.2 R136.2 R137.2 R138.2 R148.2 R149.2 R151.2 R152.2
PU_DDR_RST_B: R144.2
PU_I2C1_SCL: IC24.6(SCL)
PU_I2C1_SDA: IC24.5(SDA)
NetC225_1: C225.1 R146.2 R147.2
NetIC1_AD24: IC1.AD24(D1_MAPAR_ERR#) R141.1 R142.1
NetIC1_H19: IC1.H19(D1_MVREF) R143.2
NetIC1_V25: IC1.V25(D1_MDIC0) R140.2
NetIC1_Y25: IC1.Y25(D1_MDIC1) R139.2
NetIC24_7: IC24.7(WP) R150.2

Not connected (* = marked no-connect by the designer): IC1 AA22(D1_MCS3#)* AB20(D1_MCS2#)* D1(D1_TPA)*; IC16 A3(NF/TDQS_C)* N7(A17/NC)*; IC17 A3(NF/TDQS_C)* N7(A17/NC)*; IC18 A3(NF/TDQS_C)* N7(A17/NC)*; IC19 A3(NF/TDQS_C)* N7(A17/NC)*; IC20 A3(NF/TDQS_C)* N7(A17/NC)*; IC21 A3(NF/TDQS_C)* N7(A17/NC)*; IC22 A3(NF/TDQS_C)* N7(A17/NC)*; IC23 A3(NF/TDQS_C)* N7(A17/NC)*

## Notes on the sheet
- Title
- Size:
- Date:
- File:
- D
- Number:
- Time:
- Revision:
- Sheet
- of
- (in symbol LS1043ASN8QQB, part A) DDR; 1 OF 16

## Library data of the parts
C201-C208 C217-C224 = CMP-2008-04556-2: CAP CER 1UF 10V X5R 0402; Manufacturer Part Number: GRM155R61A105KE15D; Manufacturer: Murata; Material: Ceramic; Tolerance: 10%; Temperature Coefficient: 15%; Octopart: https://octopart.com/grm155r61a105ke15d-murata-197442; Lead Free: Yes; ComponentLink2Description: Datasheet; Temperature: -55°C to +85°C; Temperature Range High: +85°C; Height: 0.55mm; Capacitance: 1uF; Ipc Land Pattern Name: CAPC10050X50; ComponentLink2URL: https://search.murata.co.jp/Ceramy/image/img/A01X/G101/ENG/GRM155R61A105KE15-01A.pdf; Temperature Range Low: -55°C; Device Class L2: Capacitors; Voltage Rating: 10V; RoHS: TRUE; Device Class L1: Passive Components; Device Class L3: Ceramic Capacitors; Temperature Characteristic: X5R; Mouser Description: 0402 1 uF 10 V ±10% Tolerance X5R Surface Mount Multilayer Ceramic Capacitor; Automotive: No; Package: GRM15-0.1; Digikey Description: CAP CER 1UF 10V X5R 0402; Value: 1uF; Category: Cap
C209 C210 C213 C214 C226-C228 C231 C232 C235-C242 C245-C252 C255-C262 C265-C272 C275-C288 C291-C298 C301-C314 C317-C324 C327-C330 = CMP-2100-03641-2: CAP CER 0.1UF 16V X7R 0402; Manufacturer Part Number: GRM155R71C104KA88D; Manufacturer: Murata; Standoff Height: 0mm; Tolerance: 10%; Voltage Rating: 16Vdc; Material: Ceramic; Capacitance: 0.10μF; Value: 0.10μF; RoHS: TRUE; Temperature Characteristic: X7R; Octopart: https://octopart.com/grm155r71c104ka88d-murata-196880; Digikey Description: CAP CER 0.1UF 16V X7R 0402; Device Class L3: Ceramic Capacitors; Height: 0.55mm; ComponentLink2Description: Datasheet; Temperature Range Low: -55°C; Ipc Land Pattern Name: CAPC10050X219; ComponentLink2URL: https://search.murata.co.jp/Ceramy/image/img/A01X/G101/ENG/GRM155R71H471KA01-01A.pdf; Device Class L1: Passive Components; Lead Free: yes; Category: Cap; Package: GRM15; Temperature: -55°C to +125°C; Device Class L2: Capacitors; Temperature Range High: +125°C; Mouser Description: 0402 0.1 uF 16V ±10 % Tolerance X7R SMT Multilayer Ceramic Capacitor
C211 C212 C215 C216 C225 C229 C230 C233 C234 = CMP-2008-02796-1: Manufacturer: AVX Interconnect / Elco; Part Number: 0402YC103JAT2A
C243 C244 C253 C254 C263 C264 C273 C274 C289 C290 C299 C300 C315 C316 C325 C326 C331 = CMP-2007-03453-2: Chip Multilayer Ceramic Capacitors for General Purpose, 0805, 10uF, X5R, 15%, 10%, 16V; Radiation Hardening: No; Thickness: 0.053inch; Voltage Rating (DC): 16V; Lead Free: Lead Free; Package Quantity: 1; Width: 1.25mm; Case Code (Imperial): 0805; Depth: 1.25mm; Packaging: Tape and Reel; Dielectric: X5R; Max Operating Temperature: 85°C; Tolerance: 10%; Voltage Rating: 16V; Voltage: 16V; Capacitance: 10uF; Height: 1.25mm; Case Code (Metric): 2012; Material: Ceramic; Mount: Surface Mount; Case/Package: 0805; REACH SVHC: No SVHC; Length: 2mm; Min Operating Temperature: -55°C; Termination: SMD/SMT
C332 = CMP-2008-04549-2: Chip Multilayer Ceramic Capacitors for General Purpose, 0402, 4.7uF, X5R, 15%, 20%, 6.3V; Height: 0.5mm; Weight: 0.000212oz; Length: 1mm; Case Code (Metric): 1005; Packaging: Tape and Reel; Termination: SMD/SMT; Dielectric: X5R; Depth: 0.5mm; Case Code (Imperial): 0402; Min Operating Temperature: -55°C; Case/Package: 0402; Voltage: 6.3V; Width: 0.02inch; Capacitance: 4.7uF; Lead Free: Lead Free; Thickness: 0.022inch; Contact Plating: Tin; REACH SVHC: No SVHC; Package Quantity: 10000; Tolerance: 20%; Voltage Rating (DC): 6.3V; Voltage Rating: 6.3V; Mount: Surface Mount; Max Operating Temperature: 85°C
IC1 = LS1043ASN8QQB: Integrated Circuit; Manufacturer_Name: NXP; Datasheet Link: http://www.nxp.com/secured/assets/documents/en/data-sheet/LS1088A.pdf; Height: 2.61mm; Manufacturer_Part_Number: LS1043ASN8QQB; Mouser Part Number: 771-LS1043ASN8QQB; Mouser Price/Stock: https://www.mouser.co.uk/ProductDetail/NXP-Semiconductors/LS1043ASN8QQB/?qs=AQlKX63v8RsTATOTx7X0Jg%3D%3D
IC16-IC23 = MT40A512M8SA-062E_F_TR: Integrated Circuit; Manufacturer_Name: Micron; Manufacturer_Part_Number: MT40A512M8SA-062E:F TR; Datasheet Link: https://componentsearchengine.com/Datasheets/1/MT40A512M8SA-062E_F TR.pdf; Height: 1.2mm; Mouser Part Number: 340-402508-REEL; Mouser Price/Stock: https://www.mouser.co.uk/ProductDetail/Micron/MT40A512M8SA-062EF-TR?qs=B6kkDfuK7%2FBF%2FgRBWVz2BQ%3D%3D
IC24 = AT24C04C-SSHM-T: Integrated Circuit; Manufacturer_Name: Microchip; Datasheet Link: https://datasheet.lcsc.com/szlcsc/Microchip-Tech-AT24C04C-SSHM-T_C6205.pdf; Height: 1.75mm; Manufacturer_Part_Number: AT24C04C-SSHM-T; Mouser Part Number: 556-AT24C04C-SSHM-T; Mouser Price/Stock: https://www.mouser.co.uk/ProductDetail/Microchip-Technology-Atmel/AT24C04C-SSHM-T?qs=rNaVQffb%252BtcPg4SMgvVriA%3D%3D; Arrow Part Number: AT24C04C-SSHM-T; Arrow Price/Stock: https://www.arrow.com/en/products/at24c04c-sshm-t/microchip-technology
R135-R138 R148 R149 R151 R152 = CMP-2002-08397-1: Manufacturer: Vishay Dale; Part Number: CRCW0402240RFKED
R139 R140 = CMP-2002-08231-1: Part Number: CRCW0402162RFKED; Manufacturer: Vishay Dale
R141 = CMP-2002-00051-3: RES Thick Film, 4.7kΩ, 1%, 0.063W, 100ppm/°C, 0402; Voltage Rating (DC): 50V; Power Rating: 63mW; Resistance: 4.7kR; Termination: SMD/SMT; Military Standard: Not; Length: 1mm; Radiation Hardening: No; Max Operating Temperature: 155°C; Min Operating Temperature: -55°C; Package Quantity: 10; Width: 0.5mm; Case Code (Imperial): 0402; Number of Terminations: 2; Max Power Dissipation: 63mW; Tolerance: 1%; Features: Automotive AEC-Q200; Composition: Thick Film; Depth: 0.5mm; Mount: Surface Mount; Weight: 2.3E-05oz; Lead Free: Lead Free; Case/Package: 0402; Height: 0.35mm; Packaging: Tape and Reel; Temperature Coefficient: 100ppm/°C; Case Code (Metric): 1005; Voltage Rating: 50V; Contact Plating: Tin
R142 R143 = CMP-2002-08122-2: RES Thick Film, 0Ω, 0.063W, 0402; Tolerance: 5%; Max Power Dissipation: 63mW; Voltage Rating: 50V; Temperature Coefficient: 100ppm/°C; Resistance: 0mR; Contact Plating: Tin; Height: 0.35mm; Radiation Hardening: No; Features: Automotive AEC-Q200; Composition: Thick Film; Width: 0.5mm; Weight: 2.3E-05oz; Termination: SMD/SMT; Packaging: Tape and Reel; Mount: Surface Mount; Case Code (Metric): 1005; Military Standard: Not; Min Operating Temperature: -55°C; Number of Terminations: 2; Package Quantity: 1; Case Code (Imperial): 0402; Depth: 0.5mm; Max Operating Temperature: 155°C; Case/Package: 0402; Power Rating: 63mW; Lead Free: Lead Free; Voltage Rating (DC): 50V; Length: 1mm
R144 R145 R150 = CMP-2002-01154-4: Chip Resistor, 4.7 KOhm, +/- 1%, 0.1 W, -55 to 155 degC, 0402 (1005 Metric), RoHS, Tape and Reel; PartNumber: ERJ-2RKF4701X; Voltage Rating: 50 V; Case\/Package: 0402; Power Rating: 100 mW; Height: 0.35 mm; Mounting Technology: Surface Mount; REACH SVHC: Yes; Resistance: 4.7 KOhm; Max Operating Temperature: 155 degC; ComponentLink1Description: Manufacturer URL; ComponentLink2Description: Datasheet; Pins: 2; PackageReference: 0402; Tolerance: 1%; Case Code (Imperial): 0402; Length: 1 mm; PackageDescription: 2-Pin Surface Mount Device, Body 1 x 0.5 mm; RoHSCompliant: true; Package Quantity: 1; Radiation Hardening: No; DatasheetVersion: 04/2015; Width: 0.5 mm; Case Code (Metric): 1005; Mount: Surface Mount; ComponentLink1URL: http://www.panasonic.com/; Min Operating Temperature: -55 degC; Packaging: Cut Tape; ComponentLink2URL: http://industrial.panasonic.com/cdbs/www-data/pdf/RDA0000/AOA0000C86.pdf
R146 R147 = CMP-2002-00305-1: Part Number: CRCW040236R0FKED; Manufacturer: Vishay Dale
R153-R181 = CMP-2002-00915-1: Part Number: ERJ2RKF39R0X; Manufacturer: Panasonic